# EAGLE board soundcard v2.2 (EAGLE 9.6.2), part 1 of 2
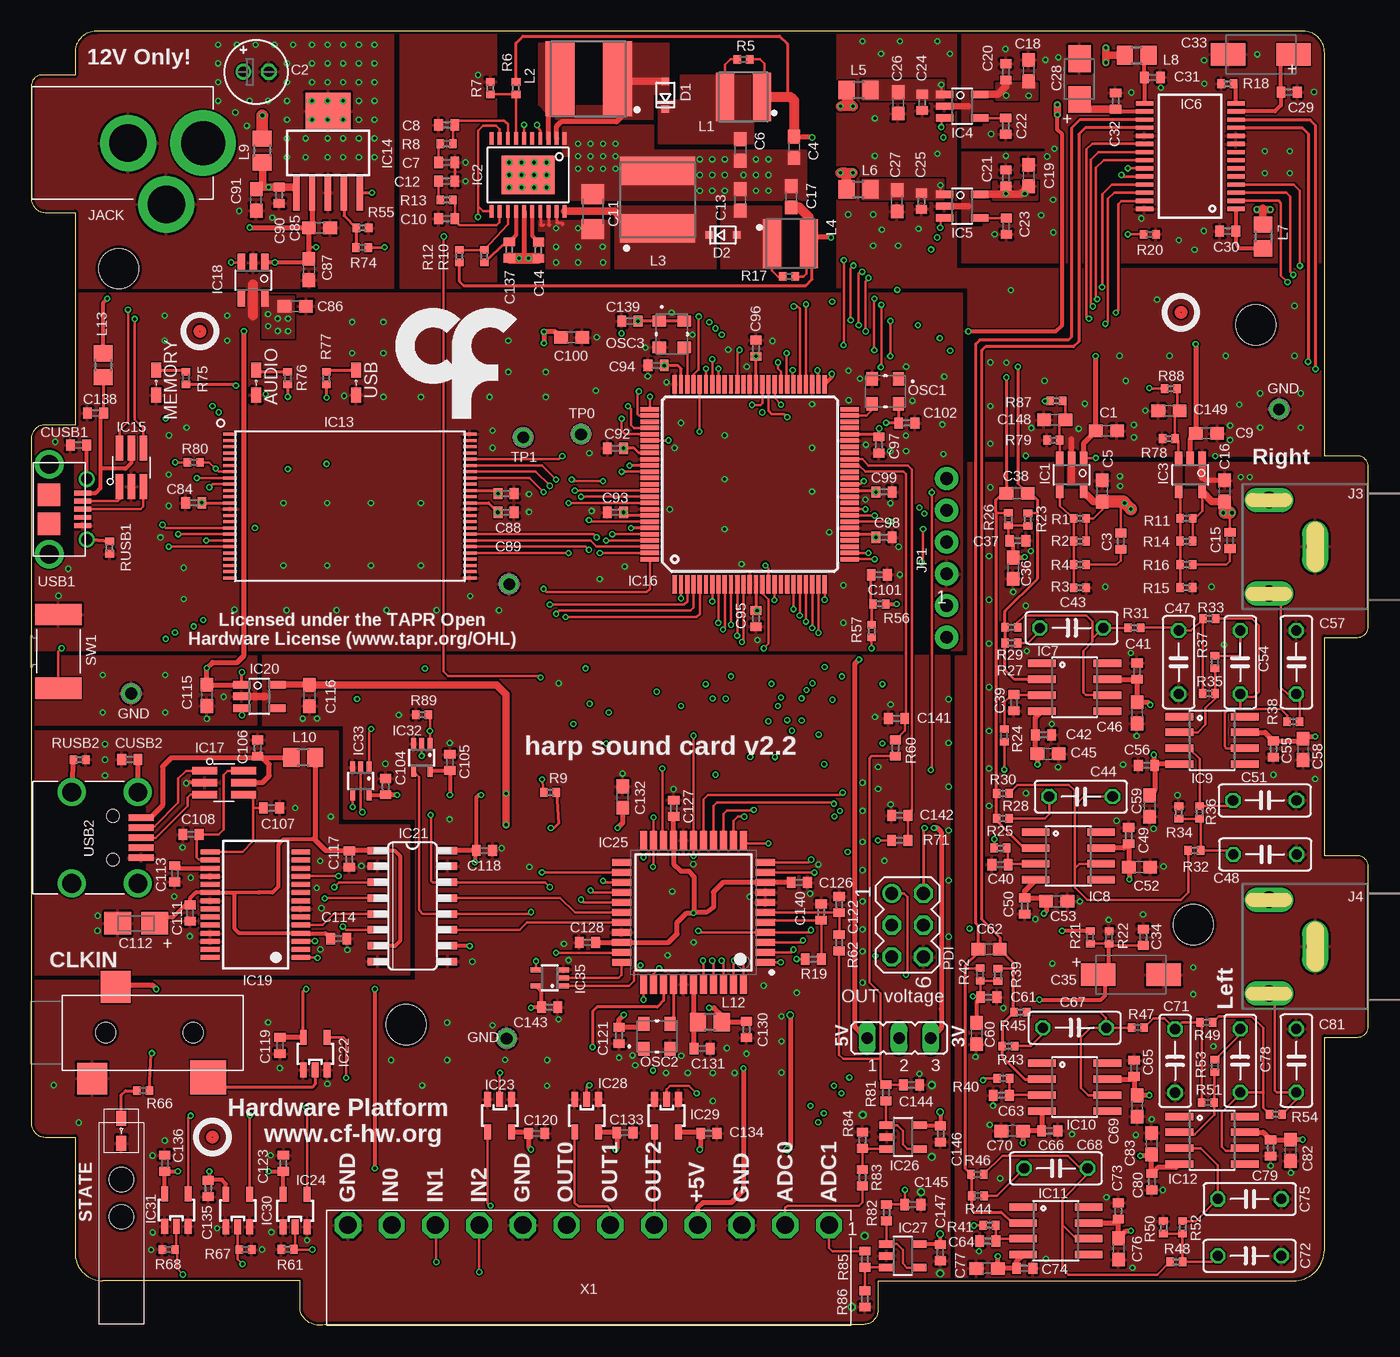
[diagram p8: board, top side]
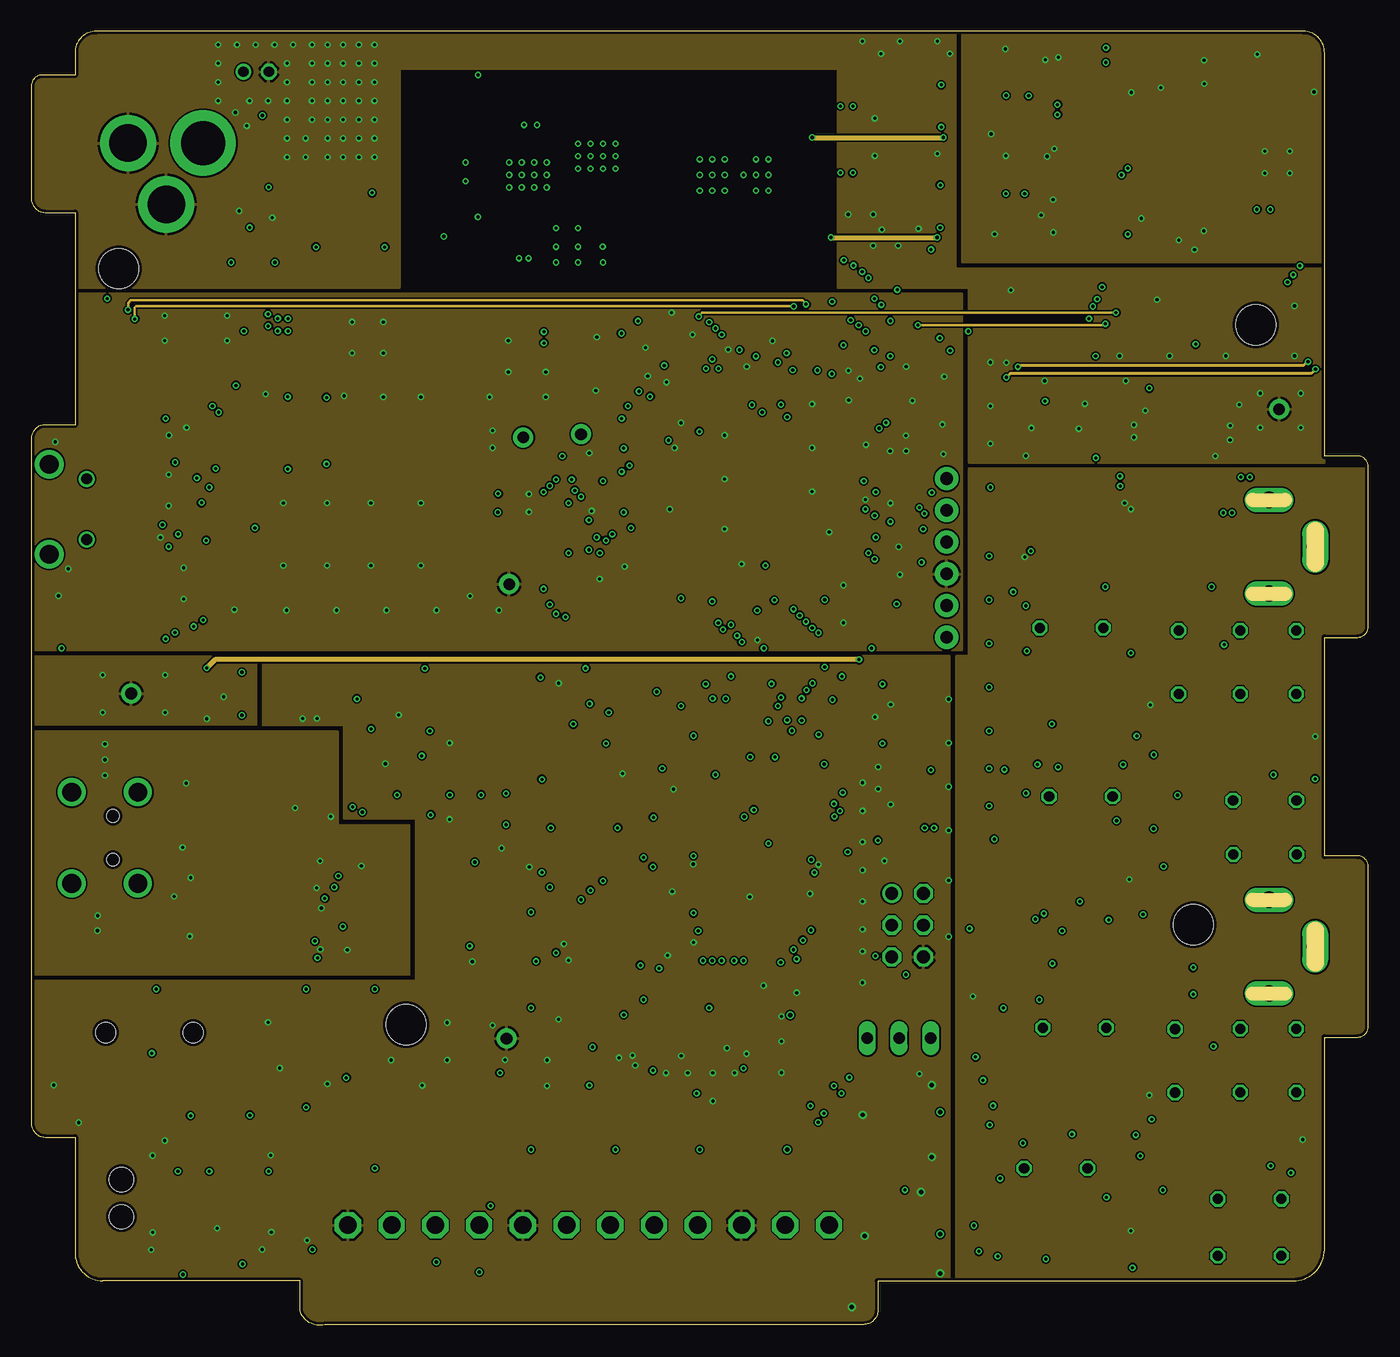
[diagram p9: board, inner layer Route2]
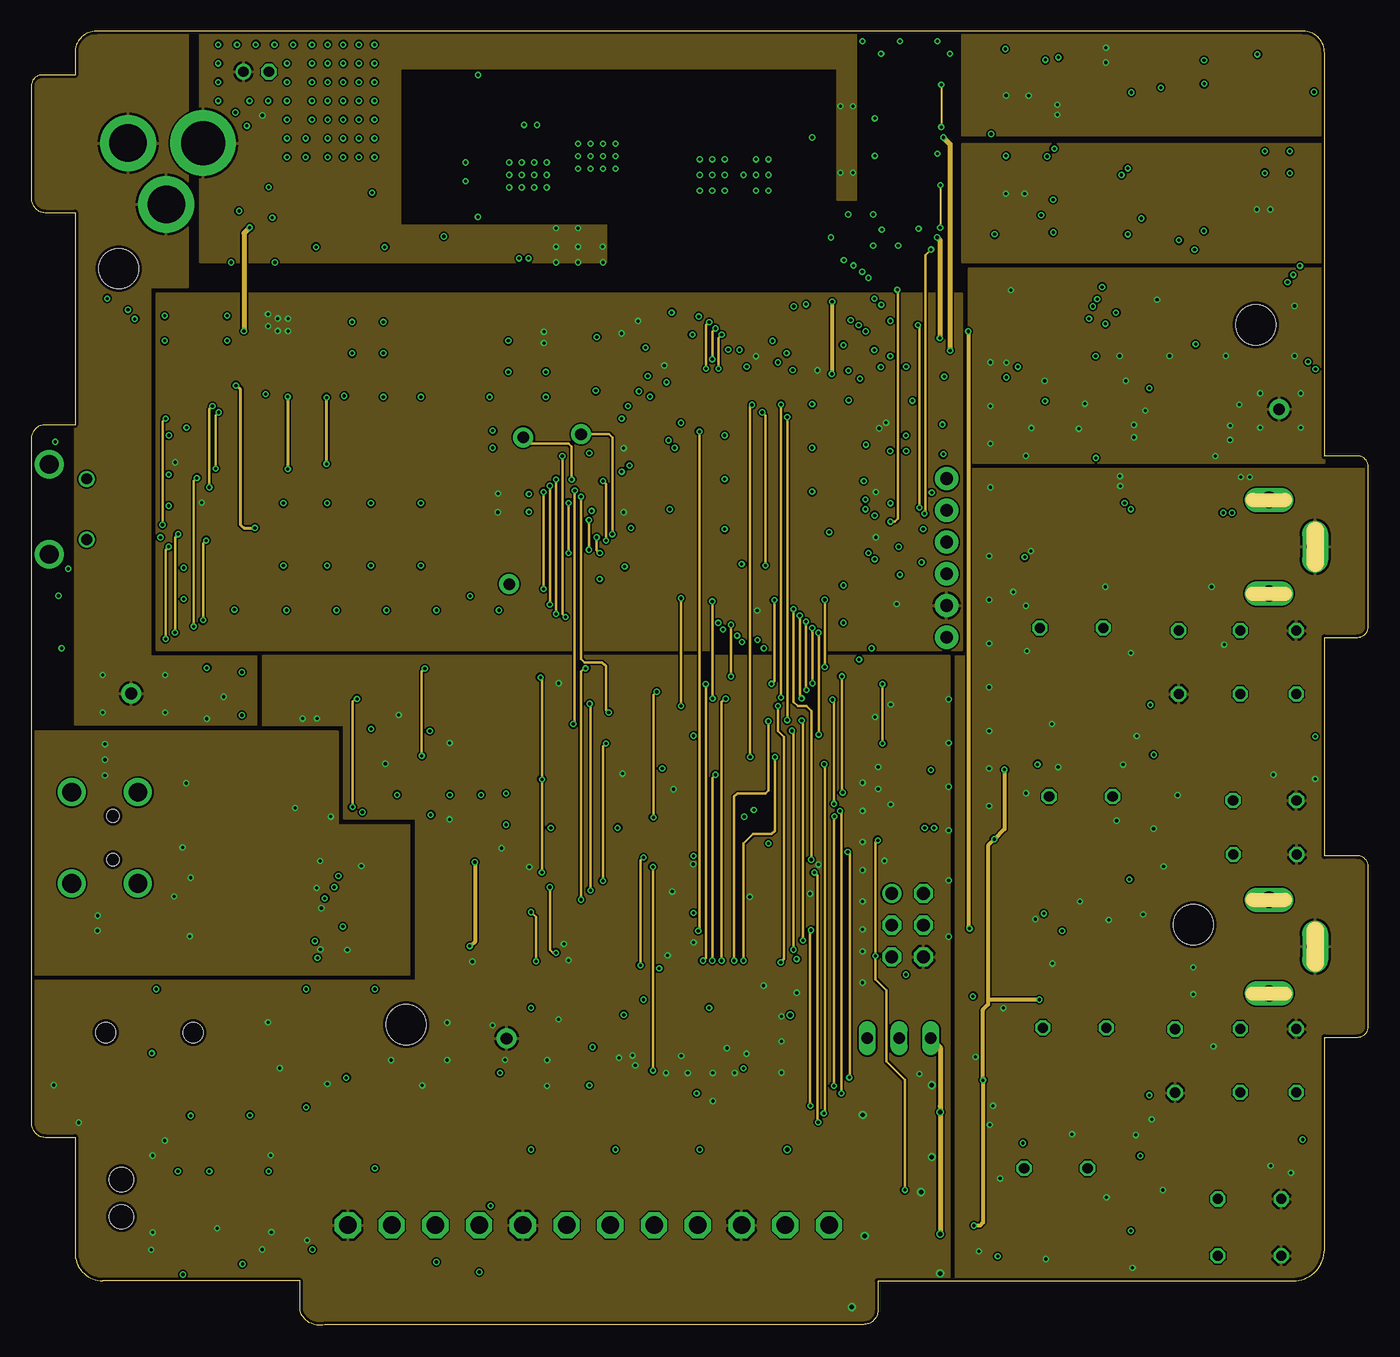
[diagram p10: board, inner layer Route3]
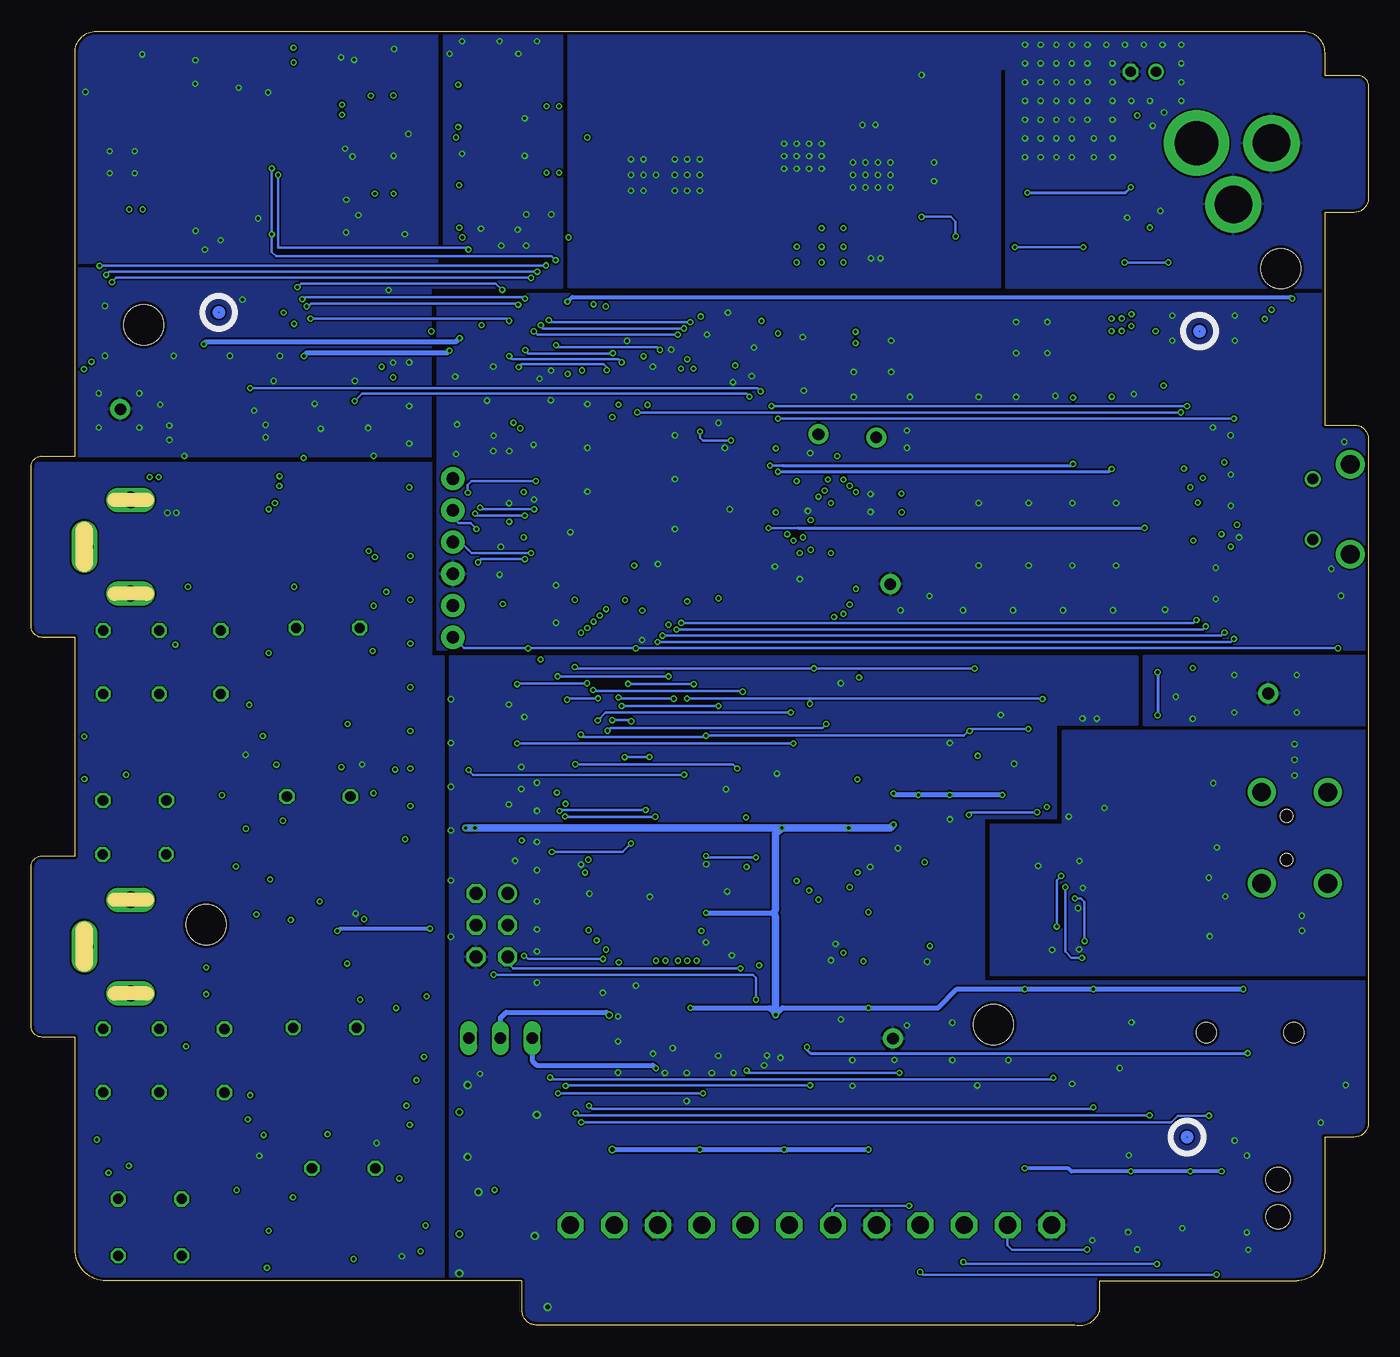
[diagram p11: board, bottom side, seen from below]

Size 107 x 103.58 mm. Coordinates in mm from the lower left corner, seen from the top.
Outline: 0,70.96 0,16.19 arc90 1.12,15.08 3.5,15.08 3.5,5.81 arc90 5.74,3.58 21.5,3.58 21.5,1.19 arc90 23.62,0.08 66.63,0.08 arc90 67.75,1.19 67.75,3.58 101,3.58 arc90 103.5,6.08 103.5,23.08 106.15,23.08 arc90 107,23.93 107,36.72 arc90 106.15,37.58 103.5,37.58 103.5,55.08 106.15,55.08 arc90 107,55.93 107,68.72 arc90 106.15,69.58 103.5,69.58 103.5,101.87 arc90 101.79,103.58 5.21,103.58 arc90 3.5,101.87 3.5,100.08 0.9,100.08 arc90 0,99.17 0,90.19 arc90 1.12,89.08 3.5,89.08 3.5,72.08 1.12,72.08 arc90 0,70.96
Copper layers (1+2*3+16): Top 0.018mm / dielectric 0.36mm / Route2 0.035mm / dielectric 0.71mm / Route3 0.035mm / dielectric 0.36mm / Bottom 0.018mm
Design rules "eC_4Layer_PClass7_BaseCopperO18-I35 *": minimum track width 0.125mm, minimum drill 0.15mm, track to track 5mil, track to pad 5mil, pad to pad 5mil, via to via 5mil, smd to smd 0mil, copper to edge 0.25mm, drill to drill 0.35mm, minimum pad ring 0.175mm, minimum via ring 0.125mm, stop-mask expansion 0mil, vias tented up to drill 0.45mm, thermal gap 0.2mm
Holes 3.2 mm at 98,80.08 7,84.58 93,32.08 30,24.08
tRestrict: 11 lines

## Footprints (pad centres in the part's own frame; a part is rotated, then mirrored left to right if it is on the bottom)
C0603 = smd 1.1 x 1: 1 -0.85,0; 2 0.85,0
E2-5 = drill 0.813 pad 1.27: + -1.016,0 | drill 0.813 pad 1.27 octagon: - 1.016,0
C0402 = smd 0.7 x 0.9: 1 -0.65,0; 2 0.65,0
C1206 = smd 1.6 x 1.8: 1 -1.4,0; 2 1.4,0
B/3528-21W = smd 2.15 x 1.8: + 1.625,0; - -1.625,0
C/6032-28W = smd 2.75 x 1.8: + 2.625,0; - -2.625,0
C050-025X075 = drill 0.813 octagon: 1 -2.54,0; 2 2.54,0
A/3216-18W = smd 2.15 x 1.8: + 1.475,0; - -1.475,0
35RASMT2BHNTRX = smd 2.4 x 2.55: 1 0.8,3.675; 5 -1.1,-3.675 | smd 2.9 x 2.75: 4 8.2,-3.575 | hole 1.6: 0,0; 7,0
SOD-323-DIODE = smd 0.6 x 0.6: A 1.1,0; C -1.1,0
TP_1 = drill 0.925 pad 1.6: TP 0,0
TSOT23-5 = smd 0.6 x 1.05: 1 -0.95,-1.354; 2 0,-1.354; 3 0.95,-1.354; 4 0.95,1.354; 5 -0.95,1.354
TSSOP-EP-20 = smd 0.305 x 0.991: 1 -2.94,-2.918; 2 -2.29,-2.918; 3 -1.64,-2.918; 4 -0.99,-2.918; 5 -0.34,-2.918; 6 0.31,-2.918; 7 0.96,-2.918; 8 1.61,-2.918; 9 2.26,-2.918; 10 2.91,-2.918; 11 2.91,2.918; 12 2.26,2.918; 13 1.61,2.918; 14 0.96,2.918; 15 0.31,2.918; 16 -0.34,2.918; 17 -0.99,2.918; 18 -1.64,2.918; 19 -2.29,2.918; 20 -2.94,2.918 | smd 4.25 x 3.05: EPAD 0,0
TSOT23-5' = smd 0.6 x 1.408: 1 -0.95,-1.404; 2 0,-1.404; 3 0.95,-1.404; 4 0.95,1.404; 5 -0.95,1.404
SSOP28 = smd 0.348 x 1.397: P1 -4.225,-3.656; P2 -3.575,-3.656; P3 -2.925,-3.656; P4 -2.275,-3.656; P5 -1.625,-3.656; P6 -0.975,-3.656; P7 -0.325,-3.656; P8 0.325,-3.656; P9 0.975,-3.656; P10 1.625,-3.656; P11 2.275,-3.656; P12 2.925,-3.656; P13 3.575,-3.656; P14 4.225,-3.656; P15 4.225,3.656; P16 3.575,3.656; P17 2.925,3.656; P18 2.275,3.656; P19 1.625,3.656; P20 0.975,3.656; P21 0.325,3.656; P22 -0.325,3.656; P23 -0.975,3.656; P24 -1.625,3.656; P25 -2.275,3.656; P26 -2.925,3.656; P27 -3.575,3.656; P28 -4.225,3.656
SO08 = smd 0.61 x 2.21: 1 -1.905,-2.616; 2 -0.635,-2.616; 3 0.635,-2.616; 4 1.905,-2.616; 5 1.905,2.616; 6 0.635,2.616; 7 -0.635,2.616; 8 -1.905,2.616
TSOP-48 = smd 0.25 x 1.1: P1 -5.75,-9.6; P2 -5.25,-9.6; P3 -4.75,-9.6; P4 -4.25,-9.6; P5 -3.75,-9.6; P6 -3.25,-9.6; P7 -2.75,-9.6; P8 -2.25,-9.6; P9 -1.75,-9.6; P10 -1.25,-9.6; P11 -0.75,-9.6; P12 -0.25,-9.6; P13 0.25,-9.6; P14 0.75,-9.6; P15 1.25,-9.6; P16 1.75,-9.6; P17 2.25,-9.6; P18 2.75,-9.6; P19 3.25,-9.6; P20 3.75,-9.6; P21 4.25,-9.6; P22 4.75,-9.6; P23 5.25,-9.6; P24 5.75,-9.6; P25 5.75,9.6; P26 5.25,9.6; P27 4.75,9.6; P28 4.25,9.6; P29 3.75,9.6; P30 3.25,9.6; P31 2.75,9.6; P32 2.25,9.6; P33 1.75,9.6; P34 1.25,9.6; P35 0.75,9.6; P36 0.25,9.6; P37 -0.25,9.6; P38 -0.75,9.6; P39 -1.25,9.6; P40 -1.75,9.6; P41 -2.25,9.6; P42 -2.75,9.6; P43 -3.25,9.6; P44 -3.75,9.6; P45 -4.25,9.6; P46 -4.75,9.6; P47 -5.25,9.6; P48 -5.75,9.6
SOT223-6 = smd 0.508 x 2.87: P$1 -2.54,-3.175; P$2 -1.27,-3.175; P$3 0,-3.175; P$4 1.27,-3.175; P$5 2.54,-3.175 | smd 3.6 x 2.962: P$6 0,3.353
SOT23-6L = smd 0.6 x 2: P$1 -0.95,-1.55; P$2 0,-1.55; P$3 0.95,-1.55; P$4 0.95,1.55; P$5 0,1.55; P$6 -0.95,1.55
TQFP-100 = smd 1.5 x 0.35: 1 -8,6; 2 -8,5.5; 3 -8,5; 4 -8,4.5; 5 -8,4; 6 -8,3.5; 7 -8,3; 8 -8,2.5; 9 -8,2; 10 -8,1.5; 11 -8,1; 12 -8,0.5; 13 -8,0; 14 -8,-0.5; 15 -8,-1; 16 -8,-1.5; 17 -8,-2; 18 -8,-2.5; 19 -8,-3; 20 -8,-3.5; 21 -8,-4; 22 -8,-4.5; 23 -8,-5; 24 -8,-5.5; 25 -8,-6; 51 8,-6; 52 8,-5.5; 53 8,-5; 54 8,-4.5; 55 8,-4; 56 8,-3.5; 57 8,-3; 58 8,-2.5; 59 8,-2; 60 8,-1.5; 61 8,-1; 62 8,-0.5; 63 8,0; 64 8,0.5; 65 8,1; 66 8,1.5; 67 8,2; 68 8,2.5; 69 8,3; 70 8,3.5; 71 8,4; 72 8,4.5; 73 8,5; 74 8,5.5; 75 8,6 | smd 0.35 x 1.5: 26 -6,-8; 27 -5.5,-8; 28 -5,-8; 29 -4.5,-8; 30 -4,-8; 31 -3.5,-8; 32 -3,-8; 33 -2.5,-8; 34 -2,-8; 35 -1.5,-8; 36 -1,-8; 37 -0.5,-8; 38 0,-8; 39 0.5,-8; 40 1,-8; 41 1.5,-8; 42 2,-8; 43 2.5,-8; 44 3,-8; 45 3.5,-8; 46 4,-8; 47 4.5,-8; 48 5,-8; 49 5.5,-8; 50 6,-8; 76 6,8; 77 5.5,8; 78 5,8; 79 4.5,8; 80 4,8; 81 3.5,8; 82 3,8; 83 2.5,8; 84 2,8; 85 1.5,8; 86 1,8; 87 0.5,8; 88 0,8; 89 -0.5,8; 90 -1,8; 91 -1.5,8; 92 -2,8; 93 -2.5,8; 94 -3,8; 95 -3.5,8; 96 -4,8; 97 -4.5,8; 98 -5,8; 99 -5.5,8; 100 -6,8
SSOP28' = smd 0.4 x 1.5: 1 -4.225,-3.625; 2 -3.575,-3.625; 3 -2.925,-3.625; 4 -2.275,-3.625; 5 -1.625,-3.625; 6 -0.975,-3.625; 7 -0.325,-3.625; 8 0.325,-3.625; 9 0.975,-3.625; 10 1.625,-3.625; 11 2.275,-3.625; 12 2.925,-3.625; 13 3.575,-3.625; 14 4.225,-3.625; 15 4.225,3.625; 16 3.575,3.625; 17 2.925,3.625; 18 2.275,3.625; 19 1.625,3.625; 20 0.975,3.625; 21 0.325,3.625; 22 -0.325,3.625; 23 -0.975,3.625; 24 -1.625,3.625; 25 -2.275,3.625; 26 -2.925,3.625; 27 -3.575,3.625; 28 -4.225,3.625
NSOIC-16 = smd 0.6 x 1.55: 1 -4.437,-2.789; 2 -3.167,-2.789; 3 -1.897,-2.789; 4 -0.627,-2.789; 5 0.643,-2.789; 6 1.913,-2.789; 7 3.183,-2.789; 8 4.453,-2.789; 9 4.453,2.811; 10 3.183,2.811; 11 1.913,2.811; 12 0.643,2.811; 13 -0.627,2.811; 14 -1.897,2.811; 15 -3.167,2.811; 16 -4.437,2.811
SOT23-5 = smd 0.55 x 1.2: 1 -0.95,-1.3; 2 0,-1.3; 3 0.95,-1.3; 4 0.95,1.3; 5 -0.95,1.3
QFP80P1200X1200X120-44N = smd 1.55 x 0.55: 1 -5.75,4; 2 -5.75,3.2; 3 -5.75,2.4; 4 -5.75,1.6; 5 -5.75,0.8; 6 -5.75,0; 7 -5.75,-0.8; 8 -5.75,-1.6; 9 -5.75,-2.4; 10 -5.75,-3.2; 11 -5.75,-4; 23 5.75,-4; 24 5.75,-3.2; 25 5.75,-2.4; 26 5.75,-1.6; 27 5.75,-0.8; 28 5.75,0; 29 5.75,0.8; 30 5.75,1.6; 31 5.75,2.4; 32 5.75,3.2; 33 5.75,4 | smd 0.55 x 1.55: 12 -4,-5.75; 13 -3.2,-5.75; 14 -2.4,-5.75; 15 -1.6,-5.75; 16 -0.8,-5.75; 17 0,-5.75; 18 0.8,-5.75; 19 1.6,-5.75; 20 2.4,-5.75; 21 3.2,-5.75; 22 4,-5.75; 34 4,5.75; 35 3.2,5.75; 36 2.4,5.75; 37 1.6,5.75; 38 0.8,5.75; 39 0,5.75; 40 -0.8,5.75; 41 -1.6,5.75; 42 -2.4,5.75; 43 -3.2,5.75; 44 -4,5.75
SOT23-5' = smd 0.6 x 1.2: 1 -0.95,-1.306; 2 0,-1.306; 3 0.95,-1.306; 4 0.95,1.306; 5 -0.95,1.306
SC-70-5 = smd 0.4 x 0.9: 1 -0.65,-1.1; 2 0,-1.1; 3 0.65,-1.1; 4 0.65,1.1; 5 -0.65,1.1
RCA = drill 1.4 long: P1 0,0 | drill 1.3 long: P2 3.7,3.75; P3 3.7,-3.75
DC_POWER_INPUT_2.1MM = drill 3.5: P1 8.5,0 | drill 3: P2 2.5,0; P3 5.55,-4.9
1X06_NO_SILK = drill 1.016 pad 1.88: 1 0,0; 2 2.54,0; 3 5.08,0; 4 7.62,0; 5 10.16,0; 6 12.7,0
JP2 = drill 0.914 long: 1 -2.54,0; 2 0,0; 3 2.54,0
IND_LPS4012_V2 = smd 1.45 x 3.89: 1 -1.475,0; 2 1.475,0
IND_LPS6225_V2 = smd 2.3 x 6: 1 -2.3,0; 2 2.3,0
R0805 = smd 1.3 x 1.5: 1 -0.95,0; 2 0.95,0
LED_HAND = smd 1.2 x 0.8: A -1,0; K 1,0
OSCILLATOR_3.2X2.5 = smd 0.9 x 1.1: P$1 -1.05,-1; P$2 1.05,-1; P$3 1.05,1; P$4 -1.05,1
MA03-2 = drill 1.016: 1 -2.54,-1.27 | drill 1.016 octagon: 2 -2.54,1.27; 3 0,-1.27; 4 0,1.27; 5 2.54,-1.27; 6 2.54,1.27
R0402 = smd 0.6 x 0.7: 1 -0.5,0; 2 0.5,0
R0402' = smd 0.7 x 0.9: 1 -0.65,0; 2 0.65,0
SWITCH_KSS = smd 1.7 x 3.7: O -2.95,0; P 2.95,0
LED_PIPE_7513D2-L = hole 1.93: -1.486,0; 1.486,0
ZX62D-B-5P8 = smd 0.4 x 1.35: P$1 -1.3,2.675; P$2 -0.65,2.675; P$3 0,2.675; P$4 0.65,2.675; P$5 1.3,2.675 | smd 1.8 x 1.8: P$6 -1.15,0; P$7 1.15,0 | drill 1.5 pad 2.3: SHIELD_1 -3.6,0; SHIELD_2 3.6,0 | drill 0.85 pad 1.25: SHIELD_3 2.425,3; SHIELD_4 -2.425,3
240-0002-1 = smd 0.5 x 2: P$1 -1.6,8.65; P$2 -0.8,8.65; P$3 0,8.65; P$4 0.8,8.65; P$5 1.6,8.65 | drill 1.5: SHIELD_1 -3.65,3.1; SHIELD_2 3.65,3.1; SHIELD_3 3.65,8.4; SHIELD_4 -3.65,8.4 | hole 1: -1.75,6.4; 1.75,6.4
CON_3.5MM_1X12 = drill 1.4 octagon: P1 -19.235,-2.54; P2 -15.735,-2.54; P3 -12.235,-2.54; P4 -8.735,-2.54; P5 -5.235,-2.54; P6 -1.735,-2.54; P7 1.765,-2.54; P8 5.265,-2.54; P9 8.765,-2.54; P10 12.265,-2.54; P11 15.765,-2.54; P12 19.265,-2.54

## Placement (x,y rotation side)
C1  2.2u  [C0603]  86.05,71.59 0 top
C2  68uF  [E2-5]  18,100.33 0 top
C3  1u  [C0402]  87.2,62.77 90 top
C4  1u  [C0603]  61.04,94.28 270 top
C5  2.2u  [C0603]  85.7,66.78 90 top
C6  1u  [C0603]  56.75,94.08 270 top
C7  820p  [C0402]  33.25,93.08 0 top
C8  47p  [C0402]  33.25,96.08 180 top
C9  2.2u  [C0603]  94.06,71.38 0 top
C10  68p  [C0402]  33.25,88.58 180 top
C11  10u  [C1206]  44.95,89.15 90 top
C12  6.8n  [C0402]  33.25,91.58 0 top
C13  1u  [C0603]  56.75,90.08 90 top
C14  1u  [C0402]  40.59,86.04 270 top
C15  100n  [C0402]  95.94,62.83 90 top
C16  2.2u  [C0603]  95.51,66.78 90 top
C17  1u  [C0603]  60.82,90.33 90 top
C18  10uF  [C0603]  79.82,100.43 270 top
C19  10uF  [C0603]  79.82,92.02 270 top
C20  100nF  [C0402]  78,100.33 270 top
C21  100nF  [C0402]  78,91.83 270 top
C22  10nF  [C0402]  77.98,95.98 90 top
C23  10nF  [C0402]  78.03,87.97 90 top
C24  100nF  [C0402]  71.3,97.88 90 top
C25  100nF  [C0402]  71.24,89.97 90 top
C26  10uF  [C0603]  69.38,97.85 90 top
C27  10uF  [C0603]  69.28,90 90 top
C28  10u  [B/3528-21W]  83.88,99.74 270 top
C29  100nF  [C0402]  100.66,98.7 0 top
C30  100nF  [C0402]  95.75,87.58 180 top
C31  100nF  [C0402]  89.73,99.88 0 top
C32  100nF  [C0402]  86.78,97.99 90 top
C33  47u  [C/6032-28W]  98.4,101.72 0 top
C34  100nF  [C0402]  89,31.08 90 top
C35  47u  [C/6032-28W]  88,28.08 180 top
C36  4.7uF  [C0603]  78.58,60.61 270 top
C37  100nF  [C0402]  78.95,62.8 180 top
C38  100pF  [C0603]  78.88,66.6 180 top
C39  100nF  [C0402]  78.65,49.84 270 top
C40  100nF  [C0402]  77.53,36.89 180 top
C41  100nF  [C0402]  88.49,52.36 90 top
C42  100nF  [C0402]  81.01,47.27 180 top
C43  100pF  [C050-025X075]  83.25,55.83 0 top
C44  100pF  [C050-025X075]  84,42.33 0 top
C45  4.7uF  [C0603]  81.37,45.74 180 top
C46  4.7uF  [C0603]  88.5,49.03 270 top
C47  5.6nF  [C050-025X075]  91.83,53.08 270 top
C48  5.6nF  [C050-025X075]  98.75,37.7 0 top
C49  100nF  [C0402]  87.82,39.21 90 top
C50  100nF  [C0402]  79.5,33.58 90 top
C51  2.7nF  [C050-025X075]  98.72,42.02 0 top
C52  4.7uF  [C0603]  88.69,36.69 0 top
C53  4.7uF  [C0603]  82.07,33.94 180 top
C54  2.7nF  [C050-025X075]  96.75,53.08 270 top
C55  100nF  [C0402]  99.41,46.13 270 top
C56  100nF  [C0402]  89.25,44.83 0 top
C57  3.9nF  [C050-025X075]  101.25,53.08 90 top
C58  4.7uF  [C0603]  101.79,46.11 270 top
C59  4.7uF  [C0603]  89.5,41.58 90 top
C60  4.7uF  [C0603]  75.64,23.36 270 top
C61  100nF  [C0402]  76.62,26.27 180 top
C62  100pF  [C0603]  76.65,30.12 180 top
C63  100nF  [C0402]  77.64,18.43 180 top
C64  100nF  [C0402]  76.56,6.76 180 top
C65  100nF  [C0402]  88.27,20.59 90 top
C66  100nF  [C0402]  81.5,15.58 180 top
C67  100pF  [C050-025X075]  83.5,23.83 0 top
C68  100pF  [C050-025X075]  82,12.58 0 top
C69  4.7uF  [C0603]  88.5,17.58 270 top
C70  4.7uF  [C0603]  78.5,15.58 0 top
C71  5.6nF  [C050-025X075]  91.54,21.18 270 top
C72  5.6nF  [C050-025X075]  97.5,5.58 0 top
C73  100nF  [C0402]  87,9.17 90 top
C74  100nF  [C0402]  79.5,4.58 180 top
C75  2.7nF  [C050-025X075]  97.51,10.12 0 top
C76  4.7uF  [C0603]  87,6.13 270 top
C77  4.7uF  [C0603]  76.5,4.58 0 top
C78  2.7nF  [C050-025X075]  96.75,21.19 270 top
C79  100nF  [C0402]  99.19,14.22 270 top
C80  100nF  [C0402]  89.68,11.5 90 top
C81  3.9nF  [C050-025X075]  101.25,21.2 90 top
C82  4.7uF  [C0603]  100.76,14.03 270 top
C83  4.7uF  [C0603]  89.66,14.56 270 top
C84  100nF  [C0402]  13,65.83 180 top
C85  10uF  [C0603]  23.07,87.84 0 top
C86  10uF  [C0603]  21.13,81.56 0 top
C87  10uF  [C0603]  22.24,84.5 270 top
C88  100nF  [C0402]  38,66.58 0 top
C89  100nF  [C0402]  38,65.08 0 top
C90  100nF  [C0402]  19.84,90.45 90 top
C91  10uF  [C0603]  18,90.08 90 top
C92  100nF  [C0402]  46.75,70.2 180 top
C93  100nF  [C0402]  46.75,65.08 180 top
C94  100nF  [C0402]  50,76.83 180 top
C95  100nF  [C0402]  58,56.58 270 top
C96  100nF  [C0402]  58,78.2 90 top
C97  100nF  [C0402]  67.84,70.46 270 top
C98  100nF  [C0402]  68.25,63.08 0 top
C99  100nF  [C0402]  68.25,66.7 0 top
C100  10uF  [C0603]  43.25,79.08 0 top
C101  100nF  [C0402]  67.86,60.08 0 top
C102  100nF  [C0402]  70.07,72.22 0 top
C104  100nF  [C0402]  28.36,43.12 90 top
C105  100nF  [C0402]  33.5,45.06 90 top
C106  100nF  [C0402]  18.12,46.21 90 top
C107  47pF  [C0402]  19.22,41.41 0 top
C108  47pF  [C0402]  12.79,39.3 180 top
C111  100nF  [C0402]  12.71,33.01 270 top
C112  4.7uF  [A/3216-18W]  8.4,32.18 0 top
C113  100nF  [C0402]  11.49,36.15 270 top
C114  100nF  [C0402]  24.61,30.96 0 top
C115  10uF  [C0603]  14.05,50.42 270 top
C116  10uF  [C0603]  22.27,50.41 270 top
C117  100nF  [C0402]  25.46,37.33 270 top
C118  100nF  [C0402]  36.27,38.01 0 top
C119  100nF  [C0402]  19.91,22.4 270 top
C120  100nF  [C0402]  40.46,15.37 0 top
C121  100nF  [C0402]  47.04,23.21 270 top
C122  10nF  [C0402]  64.67,33.69 90 top
C123  100nF  [C0402]  20.18,12.98 90 top
C126  100nF  [C0402]  61.47,35.46 0 top
C127  100nF  [C0402]  51.42,41.39 90 top
C128  100nF  [C0402]  44.51,30.66 180 top
C130  330nF  [C0402]  57.24,23.68 270 top
C131  330nF  [C0402]  53.69,22.16 0 top
C132  10uF  [C0603]  47.32,42.28 90 top
C133  100nF  [C0402]  47.51,15.43 0 top
C134  100nF  [C0402]  54.22,15.37 0 top
C135  100nF  [C0402]  14.17,10.96 270 top
C136  100nF  [C0402]  10.69,12.98 90 top
C137  1u  [C0402]  38.25,86.08 270 top
C138  100nF  [C0402]  5.14,73.02 180 top
C139  100nF  [C0402]  47.91,80.38 180 top
C140  10nF  [C0402]  63.22,33.08 90 top
C141  10nF  [C0402]  69.25,48.58 180 top
C142  10nF  [C0402]  69.5,40.83 180 top
C143  100nF  [C0402]  41.48,25.47 0 top
C144  10nF  [C0402]  70.46,19.26 180 top
C145  10nF  [C0402]  70.55,9.68 180 top
C146  100nF  [C0402]  72.77,15.34 270 top
C147  100nF  [C0402]  72.75,5.83 270 top
C148  1u  [C0603]  81.9,72.47 180 top
C149  1u  [C0603]  91.04,73.19 180 top
CLKIN  [35RASMT2BHNTRX]  5.96,23.43 0 top
CUSB1  4.7nF  [C0402]  3.79,70.46 180 top
CUSB2  4.7nF  [C0402]  7.88,45.29 180 top
D1  DIODE  [SOD-323-DIODE]  50.75,98.46 90 top
D2  DIODE  [SOD-323-DIODE]  55.35,87.26 0 top
GND  TP  [TP_1]  99.88,73.33 270 top
GND26  TP  [TP_1]  8,50.58 0 top
GND174  TP  [TP_1]  38.04,22.97 0 top
GND176  TP  [TP_1]  38.25,59.33 0 top
IC1  ADP7118  [TSOT23-5]  83.25,68.08 180 top
IC2  ADP5070EP  [TSSOP-EP-20]  39.75,92.08 180 top
IC3  ADP7182  [TSOT23-5]  92.75,68.08 180 top
IC4  LP5907MFX-3.3  [TSOT23-5']  74.5,97.58 270 top
IC5  LP5907MFX-3.3  [TSOT23-5']  74.5,89.58 270 top
IC6  AD1955  [SSOP28]  92.75,93.58 90 top
IC7  AD797  [SO08]  83.5,51.08 270 top
IC8  AD797  [SO08]  83,37.58 270 top
IC9  AD797  [SO08]  94.5,46.83 270 top
IC10  AD797  [SO08]  83.5,19.08 270 top
IC11  AD797  [SO08]  82,7.58 270 top
IC12  AD797  [SO08]  94.5,14.83 270 top
IC13  S34ML  [TSOP-48]  25.5,65.58 270 top
IC14  TPS73801  [SOT223-6]  23.75,93.83 0 top
IC15  USBLC6-2SC6  [SOT23-6L]  8.01,68.68 0 top
IC16  PIC32MZ2048EFM100  [TQFP-100]  57.5,67.33 90 top
IC17  USBLC6-2SC6  [SOT23-6L]  15.44,43.44 270 top
IC18  LP5907MFX-3.3  [TSOT23-5']  17.77,83.65 180 top
IC19  FT232RL  [SSOP28']  17.95,33.66 90 top
IC20  LP5907MFX-3.3  [TSOT23-5']  18.26,50.34 270 top
IC21  SI8642BC-B-IS1  [NSOIC-16]  30.5,33.58 270 top
IC22  SN74LVC1G125  [SOT23-5]  22.73,21.74 0 top
IC23  SN74LVC1G125  [SOT23-5]  37.48,16.8 180 top
IC24  SN74LVC1G125  [SOT23-5]  21.12,9.18 0 top
IC25  ATXMEGAxxxA4U-AU  [QFP80P1200X1200X120-44N]  53,33.06 180 top
IC26  OPA365  [SOT23-5']  69.77,15.09 270 top
IC27  OPA365  [SOT23-5']  69.75,5.58 270 top
IC28  M74VHC1GT50DTT1G  [SOT23-5]  44.45,16.79 180 top
IC29  M74VHC1GT50DTT1G  [SOT23-5]  50.84,16.8 180 top
IC30  SN74LVC1G125  [SOT23-5]  16.53,9.2 0 top
IC31  SN74LVC1G125  [SOT23-5]  11.62,9.23 0 top
IC32  VHC1GT126  [SC-70-5]  31.25,45.45 180 top
IC33  VHC1GT126  [SC-70-5]  26.38,43.58 180 top
IC35  VHC1GT125  [SC-70-5]  41.5,27.83 90 top
J3  RCARCA  [RCA]  102.75,62.33 180 top
J4  RCARCA  [RCA]  102.75,30.33 180 top
JACK  DC_JACK2.1MM  [DC_POWER_INPUT_2.1MM]  5.25,94.63 0 top
JP1  [1X06_NO_SILK]  73.25,55.08 90 top
JP2  [JP2]  69.45,22.99 0 top
L1  1.5u  [IND_LPS4012_V2]  57,98.33 180 top
L2  [IND_LPS6225_V2]  44.62,99.77 180 top
L3  [IND_LPS6225_V2]  50.12,90.09 90 top
L4  1.5u  [IND_LPS4012_V2]  60.75,86.58 0 top
L5  600@100M  [R0805]  66.22,98.88 0 top
L6  600@100M  [R0805]  66.21,90.92 0 top
L7  600@100M  [R0805]  98.59,87.15 270 top
L8  600@100M  [R0805]  88.47,101.65 0 top
L9  600@100M  [R0805]  18.49,94.02 270 top
L10  ???  [R0805]  21.76,45.45 180 top
L12  ???  [R0805]  54.31,24.28 180 top
L13  ???  [R0805]  5.76,76.85 270 top
LED1  RED  [LED_HAND]  10,75.45 270 top
LED2  RED  [LED_HAND]  18,75.45 270 top
LED3  RED  [LED_HAND]  26,75.45 270 top
OSC1  OSCILLATOR  [OSCILLATOR_3.2X2.5]  68.36,74.75 180 top
OSC2  OSCILLATOR  [OSCILLATOR_3.2X2.5]  50.07,23.14 0 top
OSC3  OSCILLATOR  [OSCILLATOR_3.2X2.5]  51.25,79.33 270 top
PDI  [MA03-2]  70.13,32.04 270 top
R1  180k  [R0402]  83.92,64.59 180 top
R2  180k  [R0402]  83.92,62.77 180 top
R3  10k  [R0402]  83.92,59.04 0 top
R4  10k  [R0402]  83.92,60.89 0 top
R5  6.04  [R0402]  57,101.33 0 top
R6  63.4k  [R0402]  38.79,99.03 90 top
R7  3.57k  [R0402]  36.75,99.03 90 top
R8  8.45k  [R0402]  33.25,94.58 180 top
R9  100k  [R0402]  41.54,42.66 0 top
R10  2.8k  [R0402]  36.25,85.58 90 top
R11  150k  [R0402]  92.45,64.59 180 top
R12  54.9k  [R0402]  34.25,85.58 90 top
R13  5.76k  [R0402]  33.25,90.08 0 top
R14  215k  [R0402]  92.45,62.77 180 top
R15  10k  [R0402]  92.45,59.05 0 top
R16  10k  [R0402]  92.45,60.89 0 top
R17  5.36  [R0402]  60.65,83.95 180 top
R18  2.49k  [R0402]  95.73,99.37 0 top
R19  15k  [R0402']  62.58,29.31 0 top
R20  100k  [R0402]  89.5,87.33 0 top
R21  2.21k  [R0402]  84.75,31.08 90 top
R22  2.80k  [R0402]  86.25,31.08 270 top
R23  2k  [R0402]  79.75,64.52 270 top
R24  806  [R0402]  77.87,47.2 270 top
R25  806  [R0402]  77.56,38.21 180 top
R26  2k  [R0402]  78.2,64.52 270 top
R27  100  [R0402]  78.44,54.62 0 top
R28  100  [R0402]  77.75,40.58 0 top
R29  2.0k  [R0402]  78.43,55.87 0 top
R30  2.0k  [R0402]  77.75,42.58 0 top
R31  681  [R0402]  88.27,55.85 0 top
R32  681  [R0402]  93.09,38.02 0 top
R33  226  [R0402]  94.27,56.57 0 top
R34  226  [R0402]  91.84,41.04 270 top
R35  324  [R0402]  94.25,50.58 0 top
R36  324  [R0402]  93.5,41.08 90 top
R37  100  [R0402]  94.72,53.08 90 top
R38  332  [R0402]  101,48.33 0 top
R39  2k  [R0402]  77.36,28.04 270 top
R40  806  [R0402]  77.79,19.77 180 top
R41  806  [R0402]  76.69,8.02 180 top
R42  2k  [R0402]  75.94,28.08 270 top
R43  100  [R0402]  78.2,22.36 0 top
R44  100  [R0402]  75.75,10.39 0 top
R45  2.0k  [R0402]  79.17,25.09 0 top
R46  2.0k  [R0402]  75.72,12.09 0 top
R47  681  [R0402]  88.56,23.83 0 top
R48  681  [R0402]  91.63,5.09 0 top
R49  226  [R0402]  94.06,24.25 0 top
R50  226  [R0402]  90.61,7.84 270 top
R51  324  [R0402]  94.17,17.84 0 top
R52  324  [R0402]  92.13,7.84 90 top
R53  100  [R0402]  94.72,20.77 90 top
R54  332  [R0402]  99.61,16.91 0 top
R55  3.16k  [R0402]  26.5,87.83 180 top
R56  10k  [R0402]  67.89,57.74 0 top
R57  1k  [R0402]  67.25,55.58 90 top
R60  15k  [R0402']  69.16,46.21 90 top
R61  100k  [R0402]  20.51,6.09 180 top
R62  15k  [R0402']  64.66,30.62 90 top
R66  100  [R0402]  8.94,18.79 0 top
R67  100k  [R0402]  17.16,6.07 0 top
R68  100k  [R0402]  10.99,6.08 180 top
R71  15k  [R0402']  69.5,38.83 0 top
R74  9.76k  [R0402]  26.5,86.26 0 top
R75  2490  [R0402]  12.38,75.83 270 top
R76  2490  [R0402]  20.53,75.8 270 top
R77  2490  [R0402]  23.62,75.8 270 top
R78  100k  [R0402]  91.02,70.97 180 top
R79  100k  [R0402]  81.79,70.85 180 top
R80  3.57k  [R0402]  13,69.08 180 top
R81  15k  [R0402']  68.4,18.62 90 top
R82  15k  [R0402']  68.44,9.04 90 top
R83  24k  [R0402']  66.52,11.84 270 top
R84  15k  [R0402']  66.52,14.84 270 top
R85  24k  [R0402']  66.72,5.31 90 top
R86  15k  [R0402']  66.72,2.13 90 top
R87  100k  [R0402]  82.06,73.99 0 top
R88  100k  [R0402]  91.2,74.97 0 top
R89  100k  [R0402]  31.3,48.87 180 top
RUSB1  1M  [R0402]  6.27,62.24 270 top
RUSB2  1M  [R0402]  3.87,45.28 0 top
STATE  GREEN  [LED_HAND]  7.21,15.59 270 top
SW1  SW1"  [SWITCH_KSS]  2.17,53.95 90 top
TP0  TP  [TP_1]  44,71.33 0 top
TP1  TP  [TP_1]  39.38,71.08 0 top
U$1  [LED_PIPE_7513D2-L]  7.21,10.18 90 top
U$2  [LOGO_6]  32.33,78.33 0 top
U$6  [FIDUCIAL]  13.5,79.58 0 top
U$8  [FIDUCIAL]  13.5,79.58 0 bottom
U$10  [FIDUCIAL]  92,81.08 0 top
U$11  [FIDUCIAL]  92,81.08 0 bottom
U$12  [FIDUCIAL]  14.5,15.08 0 top
U$13  [FIDUCIAL]  14.5,15.08 0 bottom
USB1  USB_MICRO_B  [ZX62D-B-5P8]  1.44,65.33 270 top
USB2  [240-0002-1]  0.13,39.03 270 top
X1  CON_3.5MM_1X12  [CON_3.5MM_1X12]  44.61,5.49 180 top